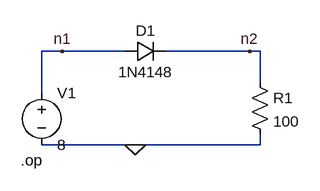
[diagram p0: schematic problem_1.asc]
problem_1.asc, the LTspice schematic file:
Version 4
SHEET 1 880 680
WIRE 16 112 -16 112
WIRE 112 112 16 112
WIRE 304 112 176 112
WIRE 320 112 304 112
WIRE 320 160 320 112
WIRE -16 176 -16 112
WIRE 128 256 -16 256
WIRE 320 256 320 240
WIRE 320 256 128 256
FLAG 128 256 0
FLAG 304 112 n2
FLAG 16 112 n1
SYMBOL diode 112 128 R270
WINDOW 0 32 32 VTop 2
WINDOW 3 0 32 VBottom 2
SYMATTR InstName D1
SYMATTR Value 1N4148
SYMBOL res 304 144 R0
SYMATTR InstName R1
SYMATTR Value 100
SYMBOL voltage -16 160 R0
WINDOW 123 0 0 Left 2
WINDOW 39 0 0 Left 2
SYMATTR InstName V1
SYMATTR Value 8
TEXT -48 280 Left 2 !.op

The netlist it stands for:
* problem_1.asc
D1 n1 n2 1N4148
R1 n2 0 100
V1 n1 0 8
.model D D
.lib standard.dio
.op
.backanno
.end